# Altium schematic sheet LiPo_Charger.SchDoc
size Letter; Author: FF7 HD Remastered; SheetNumber: 5; SheetTotal: 7
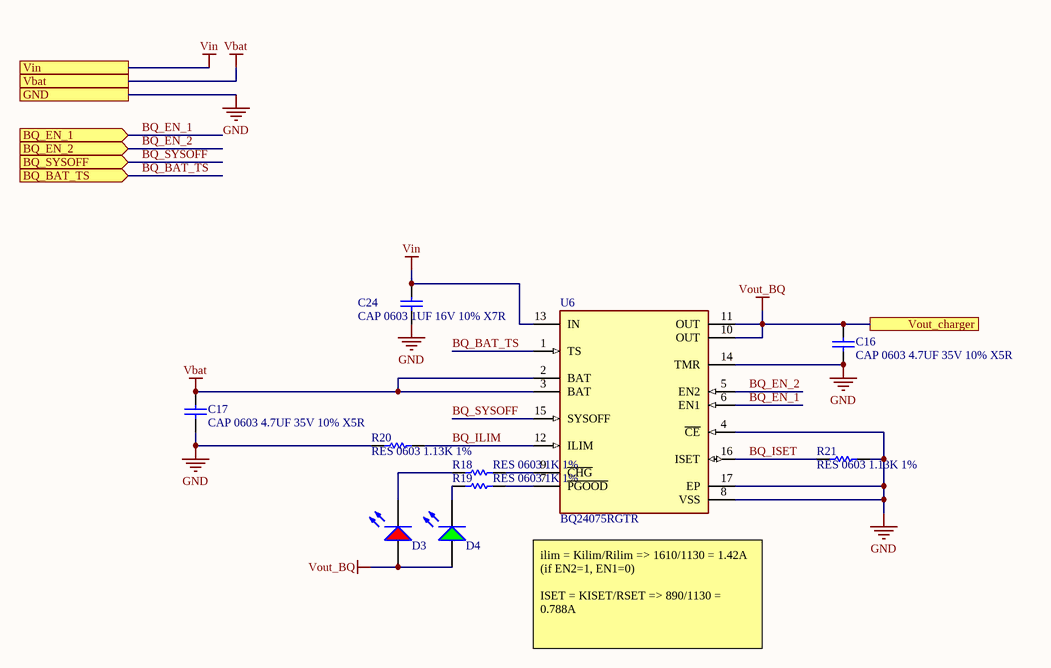
[diagram p0: LiPo_Charger.SchDoc]

## Parts
C16  CAP 0603 4.7UF 35V 10% X5R  [0603_CAP]
C17  CAP 0603 4.7UF 35V 10% X5R  [0603_CAP]
C24  CAP 0603 1UF 16V 10% X7R  [0603_CAP]
D3  LSM0805412V  [LED_0805_RED]  (value not drawn)
D4  LSM0805452V  [LED_0805]  (value not drawn)
R18  RES 0603 1K 1%  [0603_RES]
R19  RES 0603 1K 1%  [0603_RES]
R20  RES 0603 1.13K 1%  [0603_RES]
R21  RES 0603 1.13K 1%  [0603_RES]
U6  BQ24075RGTR  [FP-RGT0016C-IPC_A]

## Ports
BQ_BAT_TS (in), BQ_EN_1 (in), BQ_EN_2 (in), BQ_SYSOFF (in), GND, Vbat, Vin, Vout_charger

## Nets
GND: C16.1 C17.1 C24.1 R20.1 R21.2 U6.4(~{CE}) U6.8(VSS) U6.14(TMR) U6.17(EP) ; port GND
Vbat: C17.2 U6.2(BAT) U6.3(BAT) ; port Vbat
Vin: C24.2 U6.13(IN) ; port Vin
Vout_BQ: C16.2 D3.A D4.A U6.10(OUT) U6.11(OUT) ; port Vout_charger
BQ_BAT_TS: U6.1(TS) ; port BQ_BAT_TS
BQ_EN_1: U6.6(EN1) ; port BQ_EN_1
BQ_EN_2: U6.5(EN2) ; port BQ_EN_2
BQ_ILIM: R20.2 U6.12(ILIM)
BQ_ISET: R21.1 U6.16(ISET)
BQ_SYSOFF: U6.15(SYSOFF) ; port BQ_SYSOFF
NetD3_K: D3.K R18.2
NetD4_K: D4.K R19.2
NetR18_1: R18.1 U6.9(~{CHG})
NetR19_1: R19.1 U6.7(~{PGOOD})

## Notes on the sheet
- (near U6) ilim = Kilim/Rilim => 1610/1130 = 1.42A (if EN2=1, EN1=0)
  ISET = KISET/RSET => 890/1130 = 0.788A
- Title:
- Desc:
- Size:
- Letter
- Auth:
- Proj:
- Sheet
- of
- www.seas.upenn.edu
- Electrical and Systems Engineering

## Library data of the parts
C16 C17 = CMP-011-000330-1: Capacitor Surface Mount 0603 Footprint 47UF 35V 10% Tolerance Ceramic X5R; Manufacturer: Various; PCB Package: 0603; P/N: CAP 0603 4.7UF 35V 10% X5R; Mount: SMT; Manufacturer P/N: CAP 0603 4.7UF 35V 10% X5R; Description in Visual: CAP 0603 4.7UF 35V 10% X5R; Type: Ceramic X5R
C24 = CMP-011-000286-1: Capacitor Surface Mount 0603 Footprint 1UF 16V 10% Tolerance Ceramic X7R; Manufacturer: Various; PCB Package: 0603; Description in Visual: Cap SMT 0603 1UF 16V 10% Ceramic X7R; P/N: CAP 0603 1UF 16V 10% X7R; Manufacturer P/N: CAP 0603 1UF 16V 10% X7R; Tolerance: 10%; Type: Ceramic X7R; Value: 1UF; Mount: SMT; Voltage: 16V
D3 = CMP-00026-00001-1: Single Color LED, RED, 0805; Test Current: 20mA; Forward Voltage: 2V; RoHS Compliant: Yes
D4 = CMP-00038-3: Single Color LED, Green, 0805; Test Current: 20mA; Forward Voltage: 2V; RoHS Compliant: Yes
R18 R19 = CMP-005-002503-2: Resistor Surface Mount, 1K Ohms, 0603 Footprint, 1% Tolerance 0.1W; Manufacturer: Various; PCB Package: 0603; Description in Visual: Res SMT 1K 0603  1%  0.1W; Tolerance: 1%; Value: 1k; Mount: SMT; Power Rating: 0.1W; Manufacturer P/N: RES 0603 1K 1%; JLCPCB Part #: C21190
R20 R21 = CMP-005-001984-1: Resistor Surface Mount, 1.13K Ohms, 0603 Footprint, 1% Tolerance 0.1W; Manufacturer: Various; Description in Visual: Res SMT 1.13K 0603  1%  0.1W; PCB Package: 0603; Power Rating: 0.1W; Mount: SMT; Tolerance: 1%; Manufacturer P/N: RES 0603 1.13K 1%; Value: 1.13K
U6 = CMP-0321-00238-3: IC LI-ION CHARGE MGMT 16-QFN; Max Supply Voltage: 6.4V; Number of Cells: 1; Min Supply Voltage: 4.35V; Battery Chemistry: LITHIUM-ION; Max Charge Current: 1.5A; Output Voltage: 4.2V; Interface: USB; Min Input Voltage: 4.3V; Fault Protection: Over Voltage; Weight: 0.000808oz; Package Quantity: 3000; Min Operating Temperature: -40°C; Case/Package: VQFN; Lead Free: Lead Free; Number of Pins: 16; RoHS Compliant: Yes; Series: -; Packaging: Tape and Reel; Output Current: 1.5A; Contact Plating: Gold; Battery Pack Voltage: 4.2V; Max Operating Temperature: 125°C; Radiation Hardening: No